# Altium project FPSController.PrjPcb
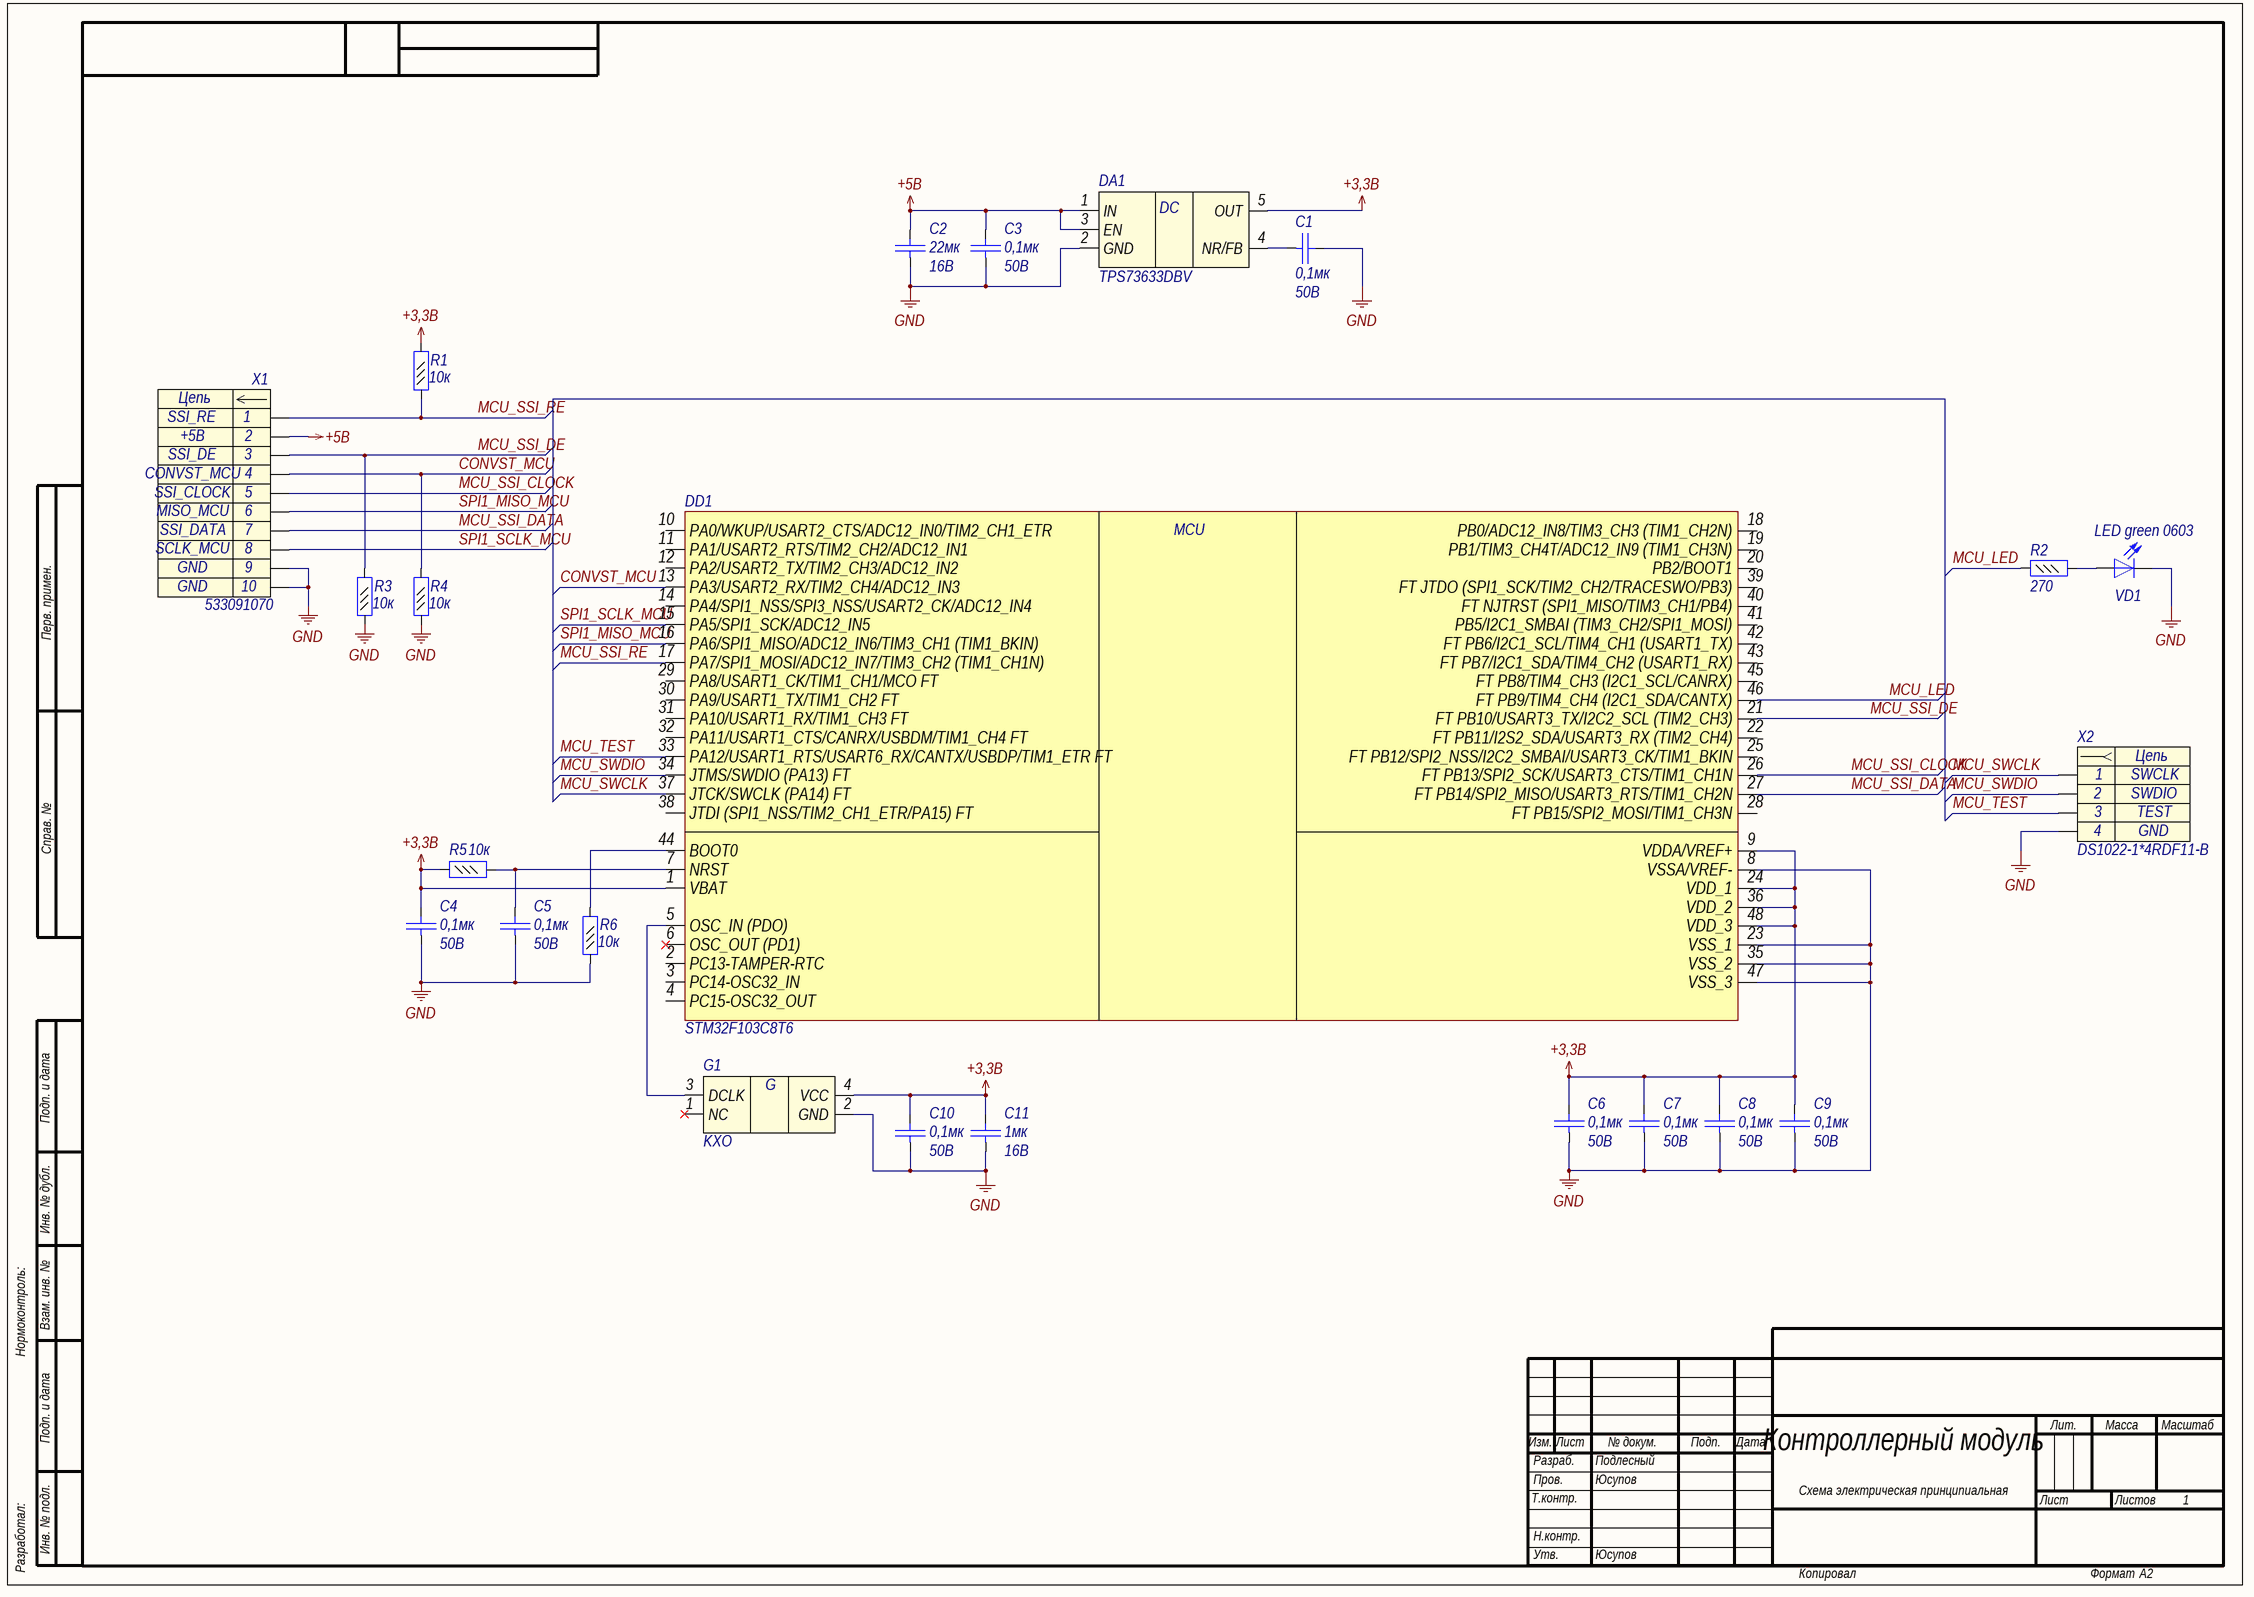
[diagram p0: FPSController.SchDoc]
1 sheet, 23 parts. Net scope: global (net labels, ports and power ports of the same name join across sheets).
Board file: FPSController.PcbDoc

## Sheet FPSController.SchDoc: Контроллерный модуль
size 594 x 420 mm; ApprovedBy: Юсупов; CheckedBy: Юсупов; DrawnBy: Подлесный; SheetTotal: 1; Format: A2; DocumentType: Схема электрическая принципиальная

### Parts
C1  Voltage: 50В  [C0402]  (hidden comment: 0,1мк)
C2  Voltage: 16B  [C1210]  (hidden comment: 22мк)
C3  Voltage: 50В  [C0402]  (hidden comment: 0,1мк)
C4  Voltage: 50В  [C0402]  (hidden comment: 0,1мк)
C5  Voltage: 50В  [C0402]  (hidden comment: 0,1мк)
C6  Voltage: 50В  [C0402]  (hidden comment: 0,1мк)
C7  Voltage: 50В  [C0402]  (hidden comment: 0,1мк)
C8  Voltage: 50В  [C0402]  (hidden comment: 0,1мк)
C9  Voltage: 50В  [C0402]  (hidden comment: 0,1мк)
C10  value 0,1мк  Voltage: 50В  [C0402]  (hidden comment: Capacitor)
C11  value 1мк  Voltage: 16B  [C0603]  (hidden comment: Capacitor)
DA1  Part Number: TPS73633DBV  [SOT23-5]  (hidden comment: TPS736DBV)
DD1  STM32F103C8T6  [LQFP48]
G1  KXO  [QSMD7x5.2x1.8]
R1  value 10к  [R0402]  (hidden comment: Resistor_0,062Вт)
R2  value 270  [R0402]  (hidden comment: Resistor_0,062Вт)
R3  value 10к  [R0402]  (hidden comment: Resistor_0,062Вт)
R4  value 10к  [R0402]  (hidden comment: Resistor_0,062Вт)
R5  value 10к  [R0402]  (hidden comment: Resistor_0,062Вт)
R6  value 10к  [R0402]  (hidden comment: Resistor_0,062Вт)
VD1  Part Name: LED green 0603  [L_0603_GREEN]  (hidden comment: LED)
X1  Part Number: 533091070  [SlimStack-10pin-angl-plg]  (hidden comment: Header_10_plg)
X2  Part Number: DS1022-1*4RDF11-B  [PLS-4R]  (hidden comment: Header_4_sct)

### Nets
+3,3B: C4.2 C6.2 C7.2 C8.2 C9.2 C10.2 C11.2 DA1.5(OUT) DD1.1(VBAT) DD1.9(VDDA/VREF+) DD1.24(VDD_1) DD1.36(VDD_2) DD1.48(VDD_3) G1.4(VCC) R1.2 R5.1
+5B: C2.2 C3.2 DA1.1(IN) DA1.3(EN) X1.2
GND: C1.2 C2.1 C3.1 C4.1 C5.1 C6.1 C7.1 C8.1 C9.1 C10.1 C11.1 DA1.2(GND) DD1.8(VSSA/VREF-) DD1.23(VSS_1) DD1.35(VSS_2) DD1.47(VSS_3) G1.2(GND) R3.1 R4.1 R6.1 VD1.1(K) X1.9 X1.10 X2.4
CONVST_MCU: DD1.13(PA3/USART2_RX/TIM2_CH4/ADC12_IN3) R4.2 X1.4
MCU_LED: DD1.46(FT_PB9/TIM4_CH4_(I2C1_SDA/CANTX)) R2.1
MCU_SSI_CLOCK: DD1.26(FT_PB13/SPI2_SCK/USART3_CTS/TIM1_CH1N) X1.5
MCU_SSI_DATA: DD1.27(FT_PB14/SPI2_MISO/USART3_RTS/TIM1_CH2N) X1.7
MCU_SSI_DE: DD1.21(FT_PB10/USART3_TX/I2C2_SCL_(TIM2_CH3)) R3.2 X1.3
MCU_SSI_RE: DD1.17(PA7/SPI1_MOSI/ADC12_IN7/TIM3_CH2_(TIM1_CH1N)) R1.1 X1.1
MCU_SWCLK: DD1.37(JTCK/SWCLK_(PA14)_FT) X2.1
MCU_SWDIO: DD1.34(JTMS/SWDIO_(PA13)_FT) X2.2
MCU_TEST: DD1.33(PA12/USART1_RTS/USART6_RX/CANTX/USBDP/TIM1_ETR_FT) X2.3
SPI1_MISO_MCU: DD1.16(PA6/SPI1_MISO/ADC12_IN6/TIM3_CH1_(TIM1_BKIN)) X1.6
SPI1_SCLK_MCU: DD1.15(PA5/SPI1_SCK/ADC12_IN5) X1.8
NetC1_1: C1.1 DA1.4(NR/FB)
NetC5_2: C5.2 DD1.7(NRST) R5.2
NetDD1_5: DD1.5(OSC_IN_(PDO)) G1.3(DCLK)
NetDD1_44: DD1.44(BOOT0) R6.2
NetR2_2: R2.2 VD1.2(A)

Not connected (* = marked no-connect by the designer): DD1 2(PC13-TAMPER-RTC) 3(PC14-OSC32_IN) 4(PC15-OSC32_OUT) 6(OSC_OUT_(PD1))* 10(PA0/WKUP/USART2_CTS/ADC12_IN0/TIM2_CH1_ETR) 11(PA1/USART2_RTS/TIM2_CH2/ADC12_IN1) 12(PA2/USART2_TX/TIM2_CH3/ADC12_IN2) 14(PA4/SPI1_NSS/SPI3_NSS/USART2_CK/ADC12_IN4) 18(PB0/ADC12_IN8/TIM3_CH3_(TIM1_CH2N)) 19(PB1/TIM3_CH4T/ADC12_IN9_(TIM1_CH3N)) 20(PB2/BOOT1) 22(FT_PB11/I2S2_SDA/USART3_RX_(TIM2_CH4)) 25(FT_PB12/SPI2_NSS/I2C2_SMBAI/USART3_CK/TIM1_BKIN) 28(FT_PB15/SPI2_MOSI/TIM1_CH3N) 29(PA8/USART1_CK/TIM1_CH1/MCO_FT) 30(PA9/USART1_TX/TIM1_CH2_FT) 31(PA10/USART1_RX/TIM1_CH3_FT) 32(PA11/USART1_CTS/CANRX/USBDM/TIM1_CH4_FT) 38(JTDI_(SPI1_NSS/TIM2_CH1_ETR/PA15)_FT) 39(FT_JTDO_(SPI1_SCK/TIM2_CH2/TRACESWO/PB3)) 40(FT_NJTRST_(SPI1_MISO/TIM3_CH1/PB4)) 41(PB5/I2C1_SMBAI_(TIM3_CH2/SPI1_MOSI)) 42(FT_PB6/I2C1_SCL/TIM4_CH1_(USART1_TX)) 43(FT_PB7/I2C1_SDA/TIM4_CH2_(USART1_RX)) 45(FT_PB8/TIM4_CH3_(I2C1_SCL/CANRX)); G1 1(NC)*

### Notes on the sheet
- Перв. примен.
- Справ. №
- Подп. и дата
- Инв. № дубл.
- Нормоконтроль:
- Взам. инв. №
- Изм.
- Лист
- № докум.
- Подп.
- Дата
- Лит.
- Масса
- Масштаб
- Т.контр.
- Пров.
- Разраб.
- Листов
- Разработал:
- Инв. № подл.
- Н.контр.
- Утв.
- Копировал
- Формат
- (in symbol connect127) Цепь
- (in symbol connect227) Цепь
- (in symbol crystal10) G
- (in symbol microcont0) MСU
- (in symbol pwr113) DC

### Library data of the parts
C1 C3-C10 = cap277: Конденсатор; Part Name: Ceramic; Manufacture: Murata; Part Number: GRM155R71H104KE14D; id: cap277; TKE: X7R; tga: 0,10%
  C1 C3-C9: Value: 0,1мк
C2 = cap294: Конденсатор; Part Name: MLCC; Manufacture: TDK; Part Number: C3225X7R1C226M; id: cap294; TKE: X7R; tga: 0,20%; Value: 22мк
C11 = cap133: Конденсатор; Part Name: Ceramic; Manufacture: Murata; Part Number: GRM188R71C105KA12D**; id: cap133; TKE: X7R
DA1 = pwr113: 400-mA Low-Dropout Regulator with Reverse Current  Protection; Manufacturer: Texas Instruments; id: pwr113; Input Voltage: 1,7-5,5В; Output Voltage: 3,3B; Dropout Voltage: 75mB; Current: 400mA; Part Name: Low-Dropout Regulator with Reverse Current Protection; Type: Linear
DD1 = microcont0: Medium-density performance line ARM®-based 32-bit MCU with 64  or 128 KB Flash, USB, CAN, 7 timers, 2 ADCs, 9 com. interfaces; Part Name: Microcontroller; Frequency: 72MHz; ADC: 10x12b; Interface: can, i2c, irda, lin, spi, uart, usb; Flash: 64kb; Pin in: 37; Power Supply: 2.0-3.6 V; id: microcont0; Part Number: STM32F103C8T6
G1 = crystal10: Кварц. генер. 32.768 МГц (HCMOS/TTL); Manufacture: GEYER; Part Number: KXO-V97; Frequence: 12MHz; id: crystal10
R1 R3 R4 R6 = res294: Резистор; Manufacture: Yageo; Part Number: RC0402FR-0710KL; id: res294; Accuracy: 0,01; Part Name: Resistor; Power: 0,062Вт
R2 = res256: Резистор; Manufacture: Yageo; Part Number: RC0402FR-07270RL; id: res256; Accuracy: 0,01; Part Name: Resistor; Power: 0,062Вт
R5 = res294: Резистор; Manufacture: Yageo; Part Number: RC0402FR-0710KL; id: res294; Accuracy: 0.01; Part Name: Resistor; Power: 0,062Вт
VD1 = diode43: Светодиод; Part Number: TO-1608BC-PG; Manufacture: OASISTEK; id: diode43
X1 = connect227: Разъем - 10 конт. вилка; Part Name: SlimStack Board-to-Board plug; Manufacture: Molex; Contact_1: SSI_RE; Contact_2: +5В; Contact_3: SSI_DE; Contact_4: CONVST_MCU; Contact_5: SSI_CLOCK; Contact_6: MISO_MCU; Etch: 0.8mm; Contact_7: SSI_DATA; Contact_8: SCLK_MCU; Contact_9: GND; System: Connector; id: connect227; Contact_10: GND
X2 = connect127: Разъем - 4 конт. розетка; Manufacture: Ningbo connfly electronic; Contact_1: SWCLK; Contact_2: SWDIO; Contact_3: TEST; Contact_4: GND; Etch: 2.54mm; Part Name: PLS-4R; id: connect127